# Altium schematic sheet Solens.SchDoc
size A4; DocumentNumber: 1; SheetNumber: 1; SheetTotal: 8
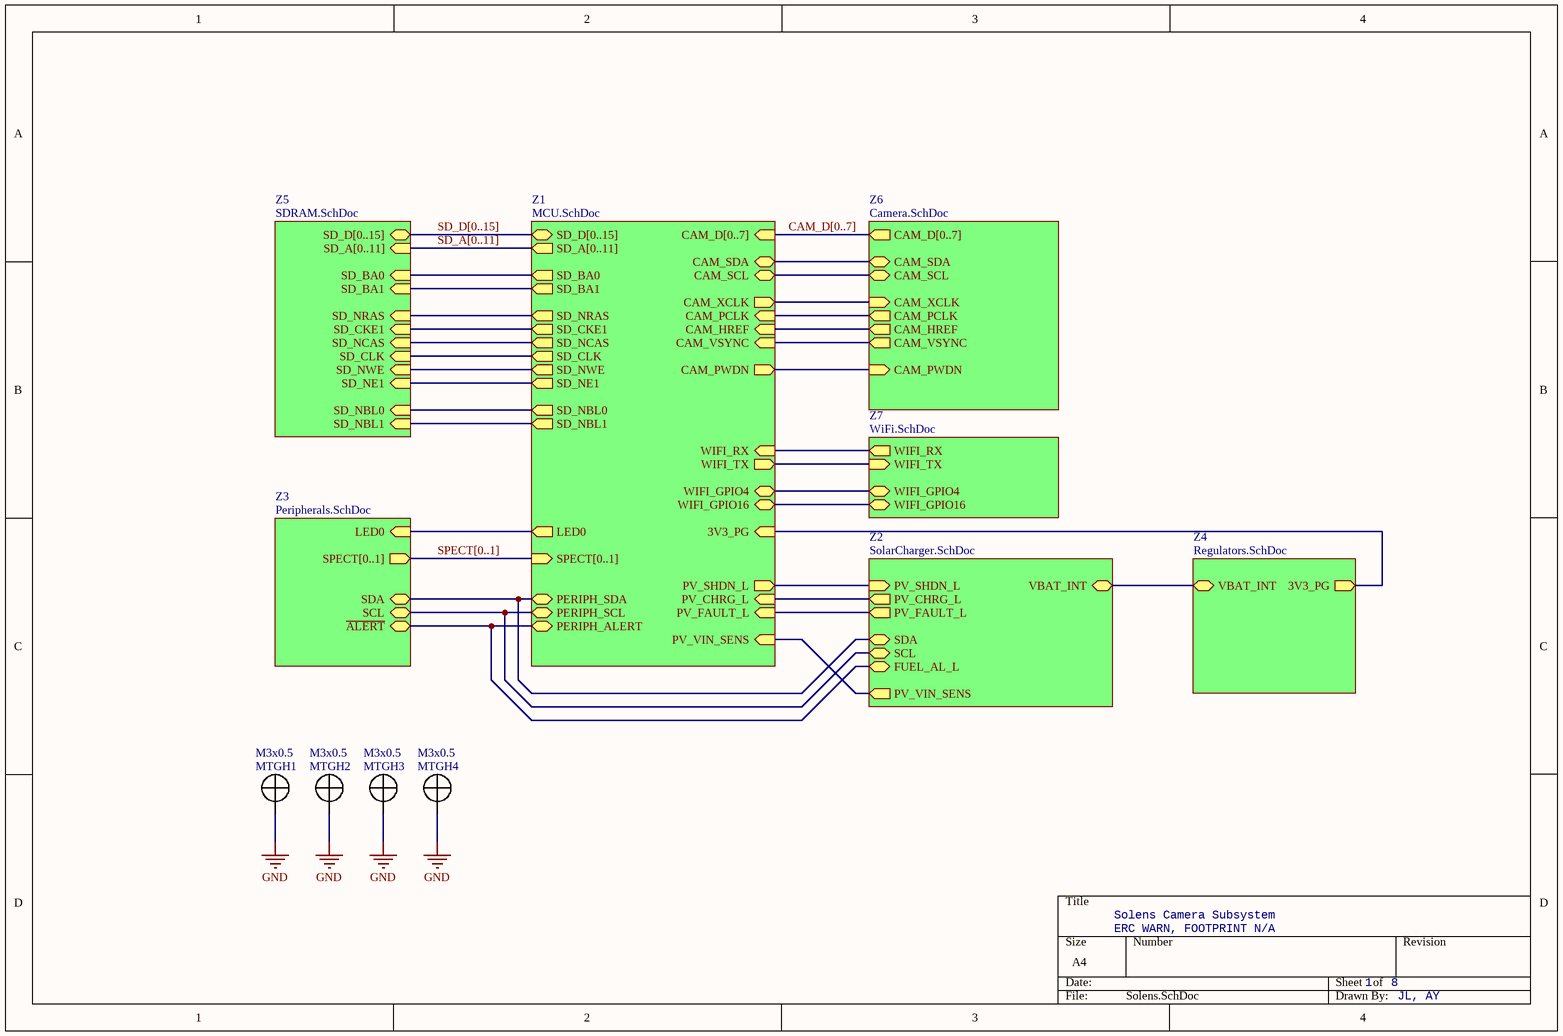
[diagram p0: Solens.SchDoc]

## Parts
MTGH1  ScrewSize: M3x0.5  [MTGH-M3x0.5-ClipSW]  (hidden comment: M3x0.5 (DNP))
MTGH2  ScrewSize: M3x0.5  [MTGH-M3x0.5-ClipNW]  (hidden comment: M3x0.5 (DNP))
MTGH3  ScrewSize: M3x0.5  [MTGH-M3x0.5-ClipNE]  (hidden comment: M3x0.5 (DNP))
MTGH4  ScrewSize: M3x0.5  [MTGH-M3x0.5]  (hidden comment: M3x0.5 (DNP))

## Sub-sheets
Z1 = MCU.SchDoc: CAM_SDA (bidir), CAM_SCL (bidir), CAM_XCLK (out), CAM_PCLK (in), CAM_HREF (in), SD_NBL0 (out), SD_NBL1 (out), SD_NRAS (out), SD_CKE1 (out), SD_NCAS (out), SD_CLK (out), SD_NWE (out), SD_NE1 (out), SD_BA1 (out), SD_BA0 (out), CAM_VSYNC (in), CAM_PWDN (out), PERIPH_SDA (bidir), PERIPH_ALERT (bidir), PERIPH_SCL (bidir), WIFI_RX (in), WIFI_TX (out), PV_FAULT_L (in), PV_CHRG_L (in), 3V3_PG (in), PV_SHDN_L (out), SD_D[0..15] (bidir), SD_A[0..11] (out), CAM_D[0..7] (in), SPECT[0..1] (in), LED0 (out), PV_VIN_SENS (in), WIFI_GPIO16 (bidir), WIFI_GPIO4 (bidir)
Z2 = SolarCharger.SchDoc: SCL (bidir), SDA (bidir), PV_FAULT_L (out), PV_CHRG_L (out), PV_SHDN_L (in), FUEL_AL_L (bidir), VBAT_INT, PV_VIN_SENS (out)
Z3 = Peripherals.SchDoc: SDA (bidir), ~{ALERT} (bidir), SCL (bidir), SPECT[0..1] (out), LED0 (in)
Z4 = Regulators.SchDoc: 3V3_PG (out), VBAT_INT
Z5 = SDRAM.SchDoc: SD_BA0 (in), SD_BA1 (in), SD_NE1 (in), SD_NWE (in), SD_NRAS (in), SD_NCAS (in), SD_CLK (in), SD_CKE1 (in), SD_NBL1 (in), SD_NBL0 (in), SD_D[0..15] (bidir), SD_A[0..11] (in)
Z6 = Camera.SchDoc: CAM_PCLK (out), CAM_XCLK (in), CAM_HREF (out), CAM_VSYNC (out), CAM_PWDN (in), CAM_SDA (bidir), CAM_SCL (bidir), CAM_D[0..7] (out)
Z7 = WiFi.SchDoc: WIFI_TX (in), WIFI_RX (out), WIFI_GPIO4 (bidir), WIFI_GPIO16 (bidir)

## Nets
GND: MTGH1.1 MTGH2.1 MTGH3.1 MTGH4.1
(unnamed): sheet Z2/SCL, sheet Z1/PERIPH_SCL, sheet Z3/SCL
(unnamed): sheet Z2/SDA, sheet Z1/PERIPH_SDA, sheet Z3/SDA
(unnamed): sheet Z2/PV_FAULT_L, sheet Z1/PV_FAULT_L
(unnamed): sheet Z2/PV_CHRG_L, sheet Z1/PV_CHRG_L
(unnamed): sheet Z2/PV_SHDN_L, sheet Z1/PV_SHDN_L
(unnamed): sheet Z2/FUEL_AL_L, sheet Z1/PERIPH_ALERT, sheet Z3/~{ALERT}
(unnamed): sheet Z2/VBAT_INT, sheet Z4/VBAT_INT
(unnamed): sheet Z2/PV_VIN_SENS, sheet Z1/PV_VIN_SENS
(unnamed): sheet Z4/3V3_PG, sheet Z1/3V3_PG
(unnamed): sheet Z5/SD_BA0, sheet Z1/SD_BA0
(unnamed): sheet Z5/SD_BA1, sheet Z1/SD_BA1
(unnamed): sheet Z5/SD_NE1, sheet Z1/SD_NE1
(unnamed): sheet Z5/SD_NWE, sheet Z1/SD_NWE
(unnamed): sheet Z5/SD_NRAS, sheet Z1/SD_NRAS
(unnamed): sheet Z5/SD_NCAS, sheet Z1/SD_NCAS
(unnamed): sheet Z5/SD_CLK, sheet Z1/SD_CLK
(unnamed): sheet Z5/SD_CKE1, sheet Z1/SD_CKE1
(unnamed): sheet Z5/SD_NBL1, sheet Z1/SD_NBL1
(unnamed): sheet Z5/SD_NBL0, sheet Z1/SD_NBL0
(unnamed): sheet Z1/CAM_SDA, sheet Z6/CAM_SDA
(unnamed): sheet Z1/CAM_SCL, sheet Z6/CAM_SCL
(unnamed): sheet Z1/CAM_XCLK, sheet Z6/CAM_XCLK
(unnamed): sheet Z1/CAM_PCLK, sheet Z6/CAM_PCLK
(unnamed): sheet Z1/CAM_HREF, sheet Z6/CAM_HREF
(unnamed): sheet Z1/CAM_VSYNC, sheet Z6/CAM_VSYNC
(unnamed): sheet Z1/CAM_PWDN, sheet Z6/CAM_PWDN
(unnamed): sheet Z1/WIFI_RX, sheet Z7/WIFI_RX
(unnamed): sheet Z1/WIFI_TX, sheet Z7/WIFI_TX
(unnamed): sheet Z1/LED0, sheet Z3/LED0
(unnamed): sheet Z1/WIFI_GPIO16, sheet Z7/WIFI_GPIO16
(unnamed): sheet Z1/WIFI_GPIO4, sheet Z7/WIFI_GPIO4

## Buses and harness runs
bus CAM_D[0..7] = sheet Z1/CAM_D[0..7] = sheet Z6/CAM_D[0..7]
bus SD_A[0..11] = sheet Z1/SD_A[0..11] = sheet Z5/SD_A[0..11]
bus SD_D[0..15] = sheet Z1/SD_D[0..15] = sheet Z5/SD_D[0..15]
bus SPECT[0..1] = sheet Z1/SPECT[0..1] = sheet Z3/SPECT[0..1]

## Notes on the sheet
- Solens Camera Subsystem
- ERC WARN, FOOTPRINT N/A
- JL, AY

## Library data of the parts
MTGH1-MTGH4 = MTGH: Mounting hole; DigikeyPN: 36-9923-ND; DNP: DNP; Value: M3x0.5 (DNP)